# Altium schematic sheet 6_ETHERNET.schdoc
size 307 x 218 mm; Symbol: Drawing-Symbol_A4; Device: Drawing-Symbol_A4; Company: 嘉立创EDA; Version: V1.0; Page Size: A4; @Project Name: 工程文件; @Page Count: 7; @Update Date: 2025-06-13; @Create Date: 2025-06-12; @Schematic Name: Schematic1; @Page No: 6; @Page Name: ETHERNET; @Create Time: 03:00:44; @Update Time: 17:03:29; Width: 1170; Height: 825; Region Start: 1; X Region Count: 6; Y Region Count: 4; Blade Width: 10; Title Block Position: 3; @Board Name: Board1
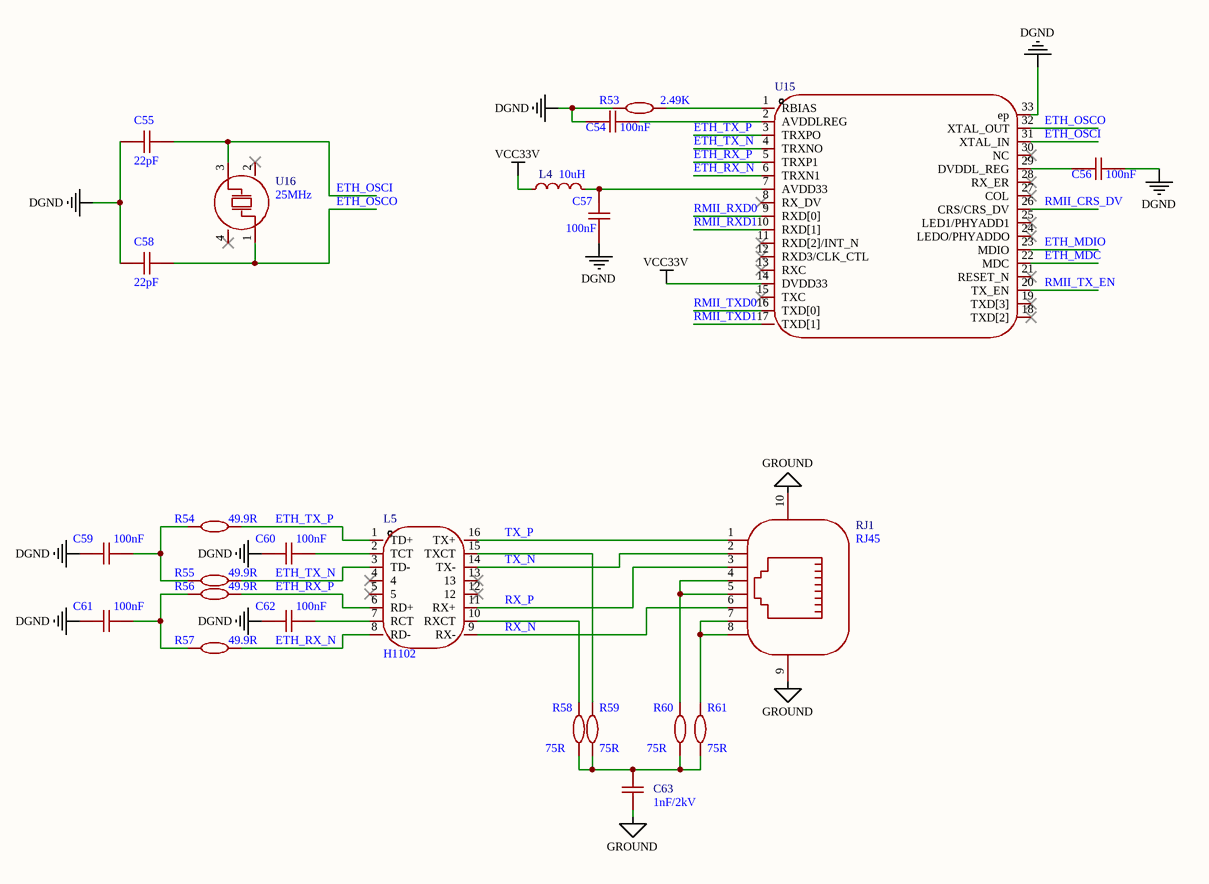
[diagram p0: 6_ETHERNET.schdoc]

## Parts
C54  100nF  [C0402]
C55  22pF  [C0402]
C56  100nF  [C0402]
C57  100nF  [C0402]
C58  22pF  [C0402]
C59  100nF  [C0603]
C60  100nF  [C0603]
C61  100nF  [C0603]
C62  100nF  [C0603]
C63  1nF/2kV  [C1206]
L4  10uH  [L0402]
L5  H1102  [XFMR-SMD_H1102N]
R53  2.49K  [R0603]
R54  49.9R  [R0603]
R55  49.9R  [R0603]
R56  49.9R  [R0603]
R57  49.9R  [R0603]
R58  75R  [R0603]
R59  75R  [R0603]
R60  75R  [R0603]
R61  75R  [R0603]
RJ1  RJ45  [RJ45-TH_R-RJ45R10P-B000-1]
U15  (no value)  [QFN-32_L5.0-W5.0-P0.50-BL-EP3.4]
U16  25MHz  [CRYSTAL-SMD_4P-L3.2-W2.5-TR]

## Nets
DGND: C54.2 C55.2 C56.1 C57.1 C58.2 C59.1 C60.1 C61.1 C62.1 R53.1 U15.33(ep)
GROUND: C63.1 RJ1.9 RJ1.10
VCC33V: L4.1 U15.14(DVDD33)
ETH_MDC: U15.22(MDC)
ETH_MDIO: U15.23(MDIO)
ETH_OSCI: C55.1 U15.31(XTAL_IN) U16.3(OSC2)
ETH_OSCO: C58.1 U15.32(XTAL_OUT) U16.1(OSC1)
ETH_RX_N: L5.8(RD-) R57.2 U15.6(TRXN1)
ETH_RX_P: L5.6(RD+) R56.2 U15.5(TRXP1)
ETH_TX_N: L5.3(TD-) R55.2 U15.4(TRXNO)
ETH_TX_P: L5.1(TD+) R54.2 U15.3(TRXPO)
RMII_CRS_DV: U15.26(CRS/CRS_DV)
RMII_RXD0: U15.9(RXD[0])
RMII_RXD1: U15.10(RXD[1])
RMII_TX_EN: U15.20(TX_EN)
RMII_TXD0: U15.16(TXD[0])
RMII_TXD1: U15.17(TXD[1])
RX_N: L5.9(RX-) RJ1.6
RX_P: L5.11(RX+) RJ1.3
TX_N: L5.14(TX-) RJ1.2
TX_P: L5.16(TX+) RJ1.1
NetC54_1: C54.1 U15.2(AVDDLREG)
NetC56_2: C56.2 U15.29(DVDDL_REG)
NetC57_2: C57.2 L4.2 U15.7(AVDD33)
NetC59_2: C59.2 R54.1 R55.1
NetC60_2: C60.2 L5.2(TCT)
NetC61_2: C61.2 R56.1 R57.1
NetC62_2: C62.2 L5.7(RCT)
NetC63_2: C63.2 R58.1 R59.1 R60.1 R61.1
NetL5_10: L5.10(RXCT) R58.2
NetL5_15: L5.15(TXCT) R59.2
NetR53_2: R53.2 U15.1(RBIAS)
NetR60_2: R60.2 RJ1.4 RJ1.5
NetR61_2: R61.2 RJ1.7 RJ1.8

Not connected (* = marked no-connect by the designer): L5 4* 5* 12* 13*; U15 8(RX_DV)* 11(RXD[2]/INT_N)* 12(RXD3/CLK_CTL)* 13(RXC)* 15(TXC)* 18(TXD[2])* 19(TXD[3])* 21(RESET_N)* 24(LEDO/PHYADDO)* 25(LED1/PHYADD1)* 27(COL)* 28(RX_ER)* 30(NC)*; U16 2(GND)* 4(GND)*

## Notes on the sheet
- 1
- 2
- 3
- 4
- 5
- 6
- A
- B
- C
- D

## Library data of the parts
C54-C58 = CAP_0402: Symbol: CapAcitance; Convert to PCB: yes; Device: CAP_0402; Add into BOM: yes
  C54 C56 C57: Value: 100nF
  C55 C58: Value: 22pF
C59-C62 = CAP_0603: Symbol: CapAcitance; Convert to PCB: yes; Device: CAP_0603; Add into BOM: yes; Value: 100nF
C63 = 1206B102K202NT: Add into BOM: yes; Tolerance: ±10%; Symbol: 1206B102K202NT; Device: 1206B102K202NT; Convert to PCB: yes; Value: 1nF/2kV
L4 = L_0402: Symbol: SDCL1005C10NJTDFM01; Add into BOM: yes; Device: L_0402; Convert to PCB: yes; Value: 10uH
L5 = H1102N: Add into BOM: yes; Symbol: H1102N; Device: H1102N; Convert to PCB: yes; Value: H1102
R53-R61 = Res_0603: Symbol: 电阻; Convert to PCB: yes; Device: Res_0603; Add into BOM: yes
  R53: Value: 2.49K
  R54-R57: Value: 49.9R
  R58-R61: Value: 75R
RJ1 = RJ45-9758-1: Add into BOM: yes; Symbol: RJ45-9758-1; Device: RJ45-9758-1; Manufacturer Part: RJ45; Convert to PCB: yes
U15 = YT8512C: Add into BOM: yes; Symbol: YT8512C; Device: YT8512C; Convert to PCB: yes
U16 = 25MHz: Add into BOM: yes; Symbol: 25MHZ; Device: 25MHz; Manufacturer Part: 25MHz; Convert to PCB: yes